# EAGLE board SparkFun RTK Express (EAGLE 9.6.2)
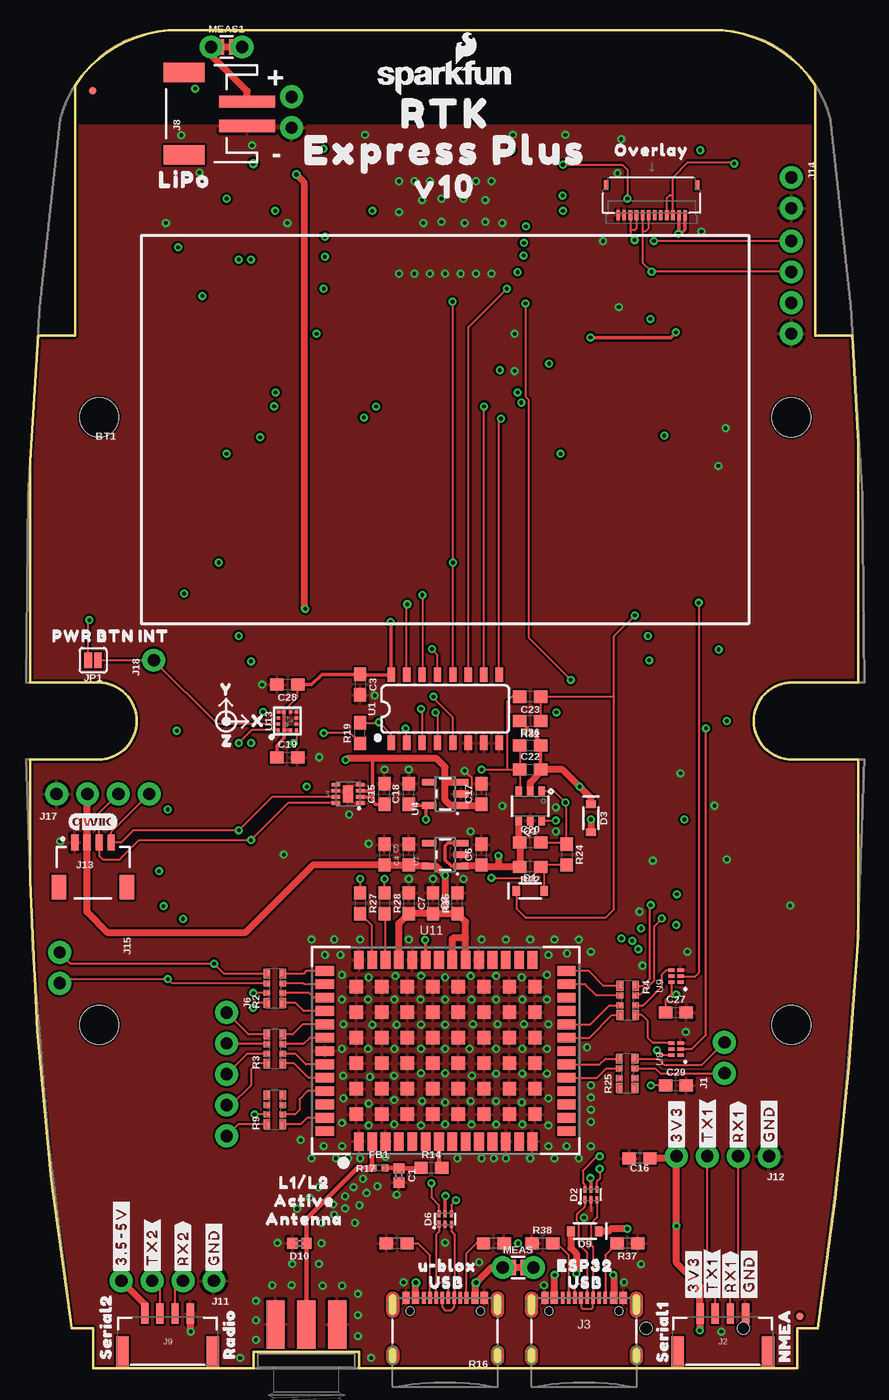
[diagram p2: board, top side]
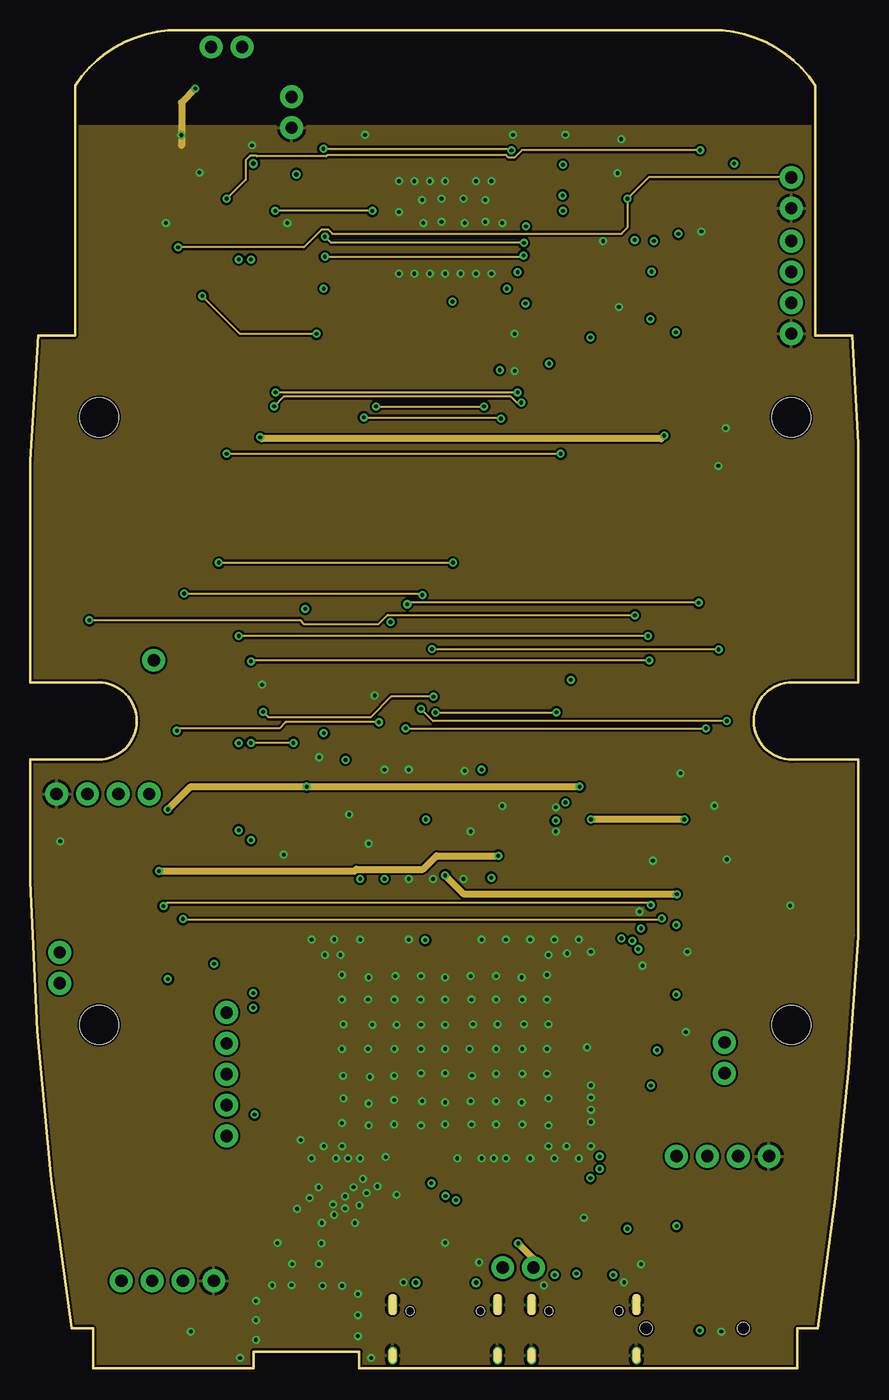
[diagram p3: board, inner layer GND/Horz]
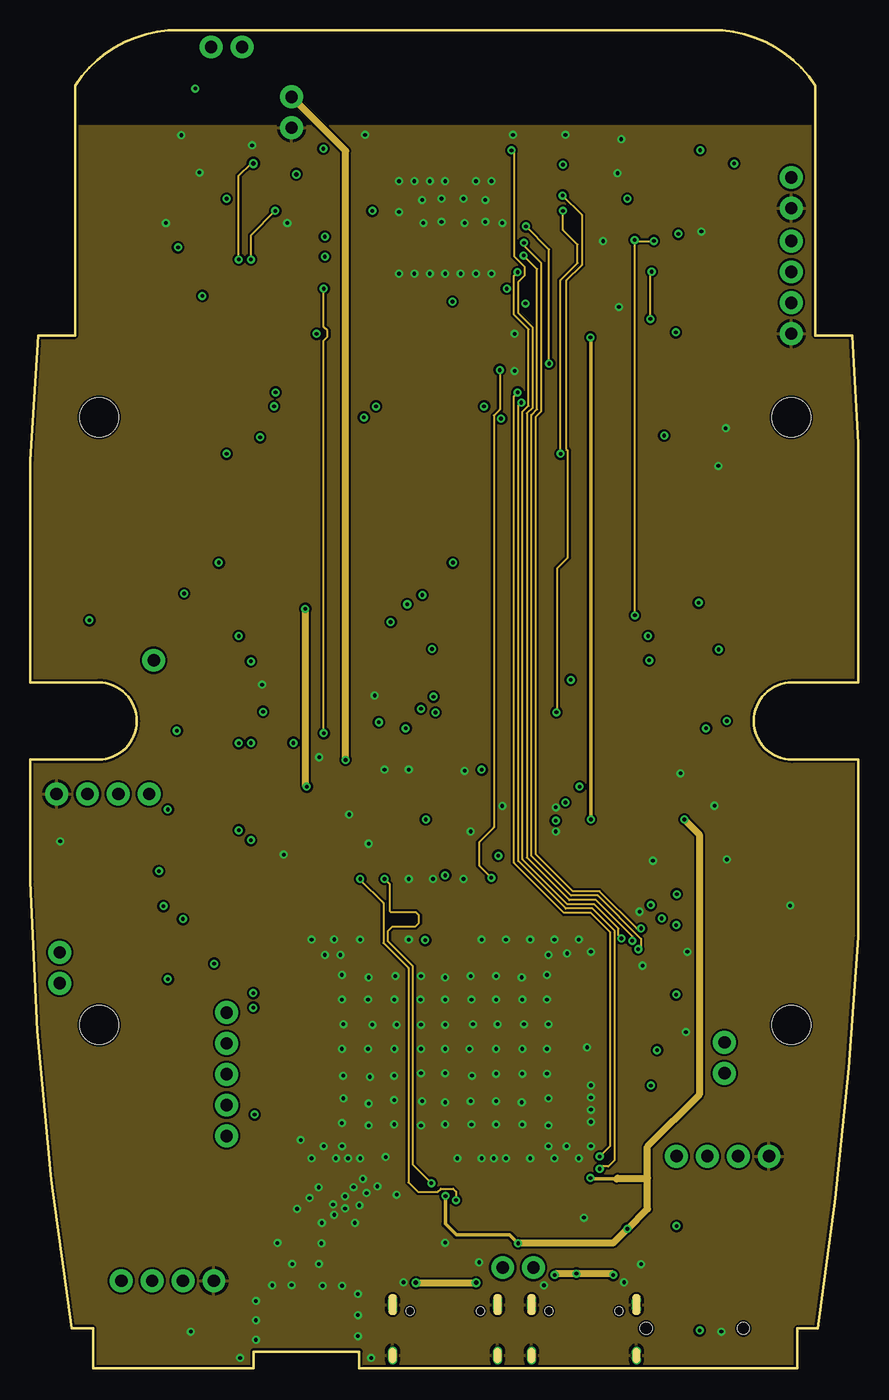
[diagram p4: board, inner layer Vert]
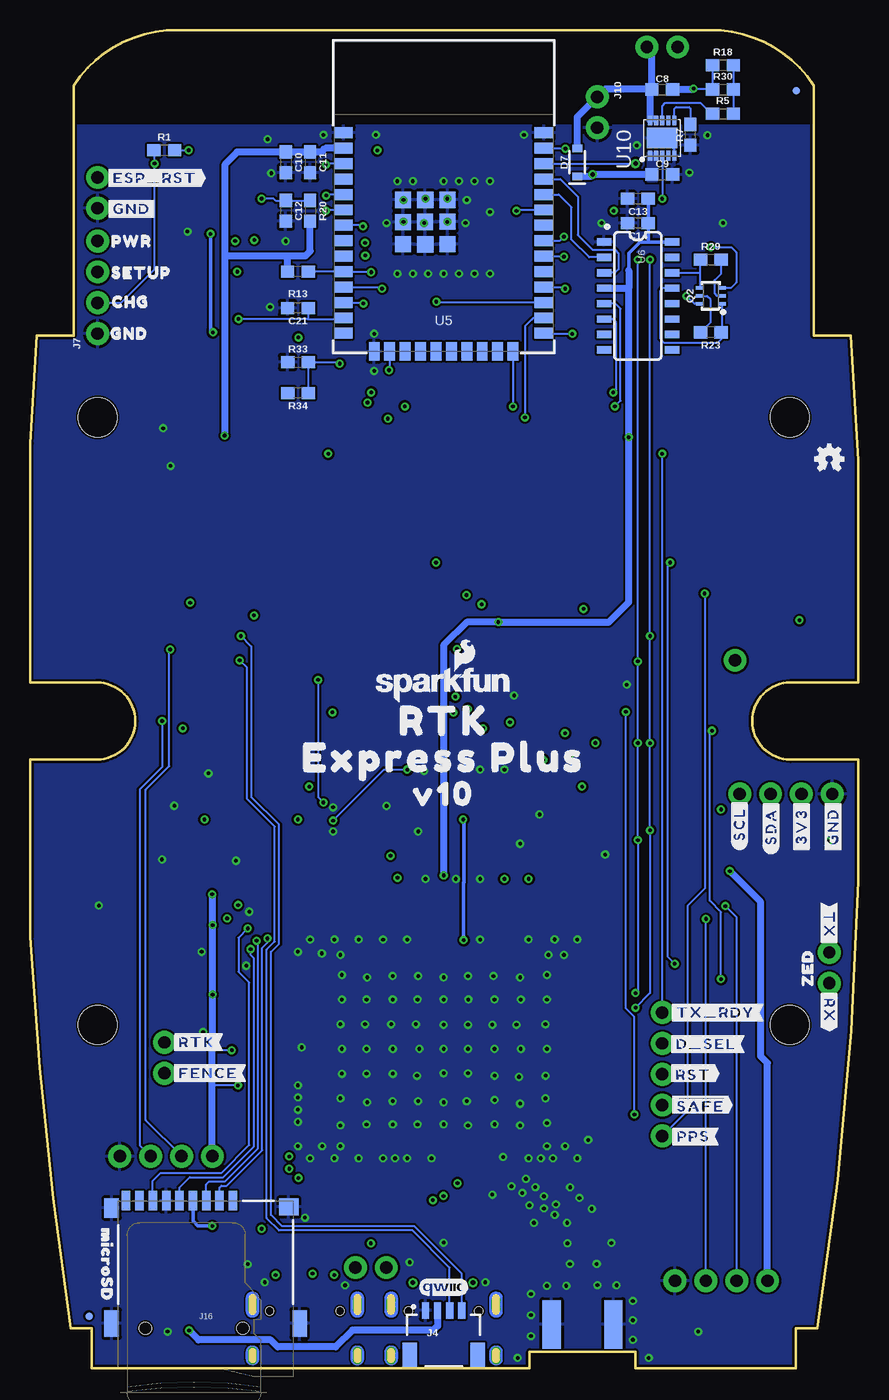
[diagram p5: board, bottom side, seen from below]

Size 68.2 x 110.14 mm. Coordinates in mm from the lower left corner, seen from the top.
Outline: 0,74.74 0,56.45 5.59,56.45 arc-180 5.59,50.1 0,50.1 0,40.07 arc8 3.41,3.27 5.16,3.27 5.16,0 18.39,0 18.39,1.36 27.09,1.36 27.09,0 63.16,0 63.16,3.27 64.86,3.27 arc5 68.2,35.49 68.2,50.1 62.74,50.1 arc-180 62.74,56.45 68.2,56.45 68.2,76.14 67.69,85.03 64.64,85.03 64.64,105.6 arc52 56.97,110.14 11.35,110.14 arc52 3.68,105.6 3.68,85.03 0.64,85.03 0,74.74
Outline: 0,74.74 0,74.87
Copper layers (1*2*15*16): Top/Horz 0.035559375mm / dielectric 0.47751875mm / GND/Horz 0.035559375mm / dielectric 0.47751875mm / Vert 0.035559375mm / dielectric 0.47751875mm / Bottom/Vert 0.035559375mm
Design rules "SparkFun-4-layer-TIGHT *": minimum track width 7mil, minimum drill 12mil, track to track 7mil, track to pad 7mil, pad to pad 7mil, via to via 7mil, smd to smd 7mil, copper to edge 7mil, drill to drill 7mil, minimum pad ring 7mil, minimum via ring 7mil, stop-mask expansion 4mil, vias tented up to drill 25mil, thermal gap 10mil
Net classes: 1 power: width 0.178 mm; 2 3.3V: width 0.559 mm; 3 RF: width 0.35 mm, clearance 0.203 mm

## Footprints (pad centres in the part's own frame; a part is rotated, then mirrored left to right if it is on the bottom)
0402 = smd 0.85 x 0.9: 1 -0.58,0; 2 0.58,0
0603 = smd 1.1 x 1: 1 -0.85,0; 2 0.85,0
SOD-323 = smd 0.63 x 0.83: A 1.15,0; C -1.15,0
SOT886 = smd 0.61 x 0.25: 1 -0.405,0.5 | smd 0.56 x 0.25: 2 -0.43,0; 3 -0.43,-0.5; 4 0.43,-0.5; 5 0.43,0; 6 0.43,0.5
SMA-EDGE = smd 1.5 x 4: GND@0 -2.54,0; GND@1 2.54,0; SIG 0,0 | smd 1.5 x 4 bottom: GND@2 -2.54,0; GND@3 2.54,0
0402-TIGHT = smd 0.6 x 0.6: 1 -0.5,0; 2 0.5,0
1X02_NO_SILK = drill 1.016 pad 1.88: 1 0,0; 2 2.54,0
JST-4-SMD-1.25MM-LOCKING = smd 0.6 x 1.7: 1 -1.875,3.3; 2 -0.625,3.3; 3 0.625,3.3; 4 1.875,3.3 | smd 1 x 2.7: NC1 3.725,0.1; NC2 -3.725,0.1
USB-C-16P_4LAYER-PADS = smd 0.3 x 1: A5 -1.25,-0.34; A6 -0.25,-0.34; A7 0.25,-0.34; A8 1.25,-0.34; B5 1.75,-0.34; B6 0.75,-0.34; B7 -0.75,-0.34; B8 -1.75,-0.34 | smd 0.6 x 1: GND -3.225,-0.34; GND2 3.225,-0.34; VBUS1 -2.45,-0.34; VBUS2 2.45,-0.34 | drill 0.4 pad 0.6 long: SHLD1 -4.318,-0.915; SHLD2 4.318,-0.915; SHLD3 -4.318,-5.095; SHLD4 4.318,-5.095 | hole 0.65: -2.89,-1.445; 2.89,-1.445
JST04_1MM_RA = smd 0.6 x 1.35: 1 -1.5,0; 2 -0.5,0; 3 0.5,0; 4 1.5,0 | smd 1.2 x 2: NC1 2.8,-3.675; NC2 -2.8,-3.675
1X05_NO_SILK = drill 1.016 pad 1.88: 1 0,0; 2 2.54,0; 3 5.08,0; 4 7.62,0; 5 10.16,0
1X04_NO_SILK = drill 1.016 pad 1.88: 1 0,0; 2 2.54,0; 3 5.08,0; 4 7.62,0
JST-2-SMD = smd 1 x 4.6: 1 -1,-3.7; 2 1,-3.7 | smd 1.6 x 3.4: NC1 -3.4,1.5; NC2 3.4,1.5
MICROSD-EXTERNALPIN = smd 0.7 x 1.6: 1 2.25,10.5; 2 1.15,10.5; 3 0.05,10.5; 4 -1.05,10.5; 5 -2.15,10.5; 6 -3.25,10.5; 7 -4.35,10.5; 8 -5.45,10.5; 9 -6.55,10.5 | smd 1.2 x 1.6: 10 -7.75,9.9 | smd 1.2 x 2.2: 11 -7.75,0.4; 12 7.75,0.4 | smd 1.6 x 1.4: 13 6.85,10 | hole 1: 3.05,0; -4.95,0
1X01_NO_SILK = drill 1.016 pad 1.88: 1 0,0
FPC_12_DOUBLESIDED_BACKFLIP = smd 0.3 x 0.8: 1 -2.75,1.35; 2 -2.25,1.35; 3 -1.75,1.35; 4 -1.25,1.35; 5 -0.75,1.35; 6 -0.25,1.35; 7 0.25,1.35; 8 0.75,1.35; 9 1.25,1.35; 10 1.75,1.35; 11 2.25,1.35; 12 2.75,1.35 | smd 0.4 x 0.8: MP1 -3.75,-1.15; MP2 3.75,-1.15
SMT-JUMPER_2_NO_SILK = smd 0.635 x 1.27: 1 -0.406,0; 2 0.406,0
FIDUCIAL-MICRO = smd 0.635 x 0.635: 1 0,0
COMBO-JUMPER_2_NC_TRACE = smd 0.635 x 1.27: 1 -0.508,0; 2 0.508,0 | drill 1.016 pad 1.88: 3 -1.27,0; 4 1.27,0
SOT26 = smd 0.55 x 0.8: D1 -0.95,1.2; D2 0.95,1.2; G1 -0.95,-1.2; G2 0.95,-1.2; S1 0,1.2; S2 0,-1.2
SC70-6 = smd 0.3 x 0.66: 1 -0.65,-0.92; 2 0,-0.92; 3 0.65,-0.92; 4 0.65,0.92; 5 0,0.92; 6 -0.65,0.92
1206_RA = smd 0.8 x 0.55: P1 -1.2,-0.62; P4 1.2,-0.62; P5 1.2,0.68; P8 -1.2,0.68 | smd 0.5 x 0.55: P2 -0.4,-0.62; P3 0.4,-0.62; P6 0.4,0.68; P7 -0.4,0.68
SO16 = smd 0.6 x 1.2: 1 -4.445,-2.8; 2 -3.175,-2.8; 3 -1.905,-2.8; 4 -0.635,-2.8; 5 0.635,-2.8; 6 1.905,-2.8; 7 3.175,-2.8; 8 4.445,-2.8; 9 4.445,2.8; 10 3.175,2.8; 11 1.905,2.8; 12 0.635,2.8; 13 -0.635,2.8; 14 -1.905,2.8; 15 -3.175,2.8; 16 -4.445,2.8
SOT23-5 = smd 0.55 x 1.2: 1 -0.95,-1.3; 2 0,-1.3; 3 0.95,-1.3; 4 0.95,1.3; 5 -0.95,1.3
ESP-WROOM-32D-NARROW = smd 0.9 x 1.5: 1 6.43,8.238; 2 5.16,8.238; 3 3.89,8.238; 4 2.62,8.238; 5 1.35,8.238; 6 0.08,8.238; 7 -1.19,8.238; 8 -2.46,8.238; 9 -3.73,8.238; 10 -5,8.238; 11 -6.27,8.238; 12 -7.54,8.238; 13 -8.81,8.238; 14 -10.08,8.238; 25 -10.08,-8.238; 26 -8.81,-8.238; 27 -7.54,-8.238; 28 -6.27,-8.238; 29 -5,-8.238; 30 -3.73,-8.238; 31 -2.46,-8.238; 32 -1.19,-8.238; 33 0.08,-8.238; 34 1.35,-8.238; 35 2.62,-8.238; 36 3.89,-8.238; 37 5.16,-8.238; 38 6.43,-8.238 | smd 1.5 x 0.9: 15 -11.57,5.715; 16 -11.57,4.445; 17 -11.57,3.175; 18 -11.57,1.905; 19 -11.57,0.635; 20 -11.57,-0.635; 21 -11.57,-1.905; 22 -11.57,-3.175; 23 -11.57,-4.445; 24 -11.57,-5.715 | smd 1.33 x 1.33: GND1 -0.912,1.531; GNDT1 -2.751,3.346; GNDT2 -2.761,1.516; GNDT3 -2.751,-0.314; GNDT4 -0.891,-0.324; GNDT5 0.909,-0.314; GNDT6 0.909,1.516; GNDT7 0.909,3.346; GNDT8 -0.921,3.346
SO016 = smd 0.6 x 1.2: 1 -4.445,-2.8; 2 -3.175,-2.8; 3 -1.905,-2.8; 4 -0.635,-2.8; 5 0.635,-2.8; 6 1.905,-2.8; 7 3.175,-2.8; 8 4.445,-2.8; 9 4.445,2.8; 10 3.175,2.8; 11 1.905,2.8; 12 0.635,2.8; 13 -0.635,2.8; 14 -1.905,2.8; 15 -3.175,2.8; 16 -4.445,2.8
DFN-8 = smd 0.3 x 0.7: 1 -0.75,-0.99; 2 -0.25,-0.99; 3 0.25,-0.99; 4 0.75,-0.99; 5 0.75,0.99; 6 0.25,0.99; 7 -0.25,0.99; 8 -0.75,0.99 | smd 1.38 x 0.8: 9 0,0
SIP6 = smd 0.3 x 0.52: P1 -0.508,-0.381; P2 -0.008,-0.381; P3 0.492,-0.381; P4 0.492,0.369; P5 -0.008,0.369; P6 -0.508,0.369
DFN-10 = smd 0.8 x 0.35: 1 -1.45,1; 2 -1.45,0.5; 3 -1.45,0; 4 -1.45,-0.5; 5 -1.45,-1; 6 1.45,-1; 7 1.45,-0.5; 8 1.45,0; 9 1.45,0.5; 10 1.45,1 | smd 1.7 x 2.5: 11 0,0
UBLOX_ZED_F9R = smd 1.1 x 1.1: G1 -7.312,-5.37; G2 -5.212,-5.37; G3 -3.112,-5.37; G4 -1.012,-5.37; G5 1.088,-5.37; G6 3.188,-5.37; G7 5.288,-5.37; G8 7.388,-5.37; G9 7.388,-3.27; G10 5.288,-3.27; G11 3.188,-3.27; G12 1.088,-3.27; G13 -1.012,-3.27; G14 -3.112,-3.27; G15 -5.212,-3.27; G16 -7.312,-3.27; G17 -7.312,-1.17; G18 -5.212,-1.17; G19 -3.112,-1.17; G20 -1.012,-1.17; G21 1.088,-1.17; G22 3.188,-1.17; G23 5.288,-1.17; G24 7.388,-1.17; G25 7.388,0.93; G26 5.288,0.93; G27 3.188,0.93; G28 1.088,0.93; G29 -1.012,0.93; G30 -3.112,0.93; G31 -5.212,0.93; G32 -7.312,0.93; G33 -7.312,3.03; G34 -5.212,3.03; G35 -3.112,3.03; G36 -1.012,3.03; G37 1.088,3.03; G38 3.188,3.03; G39 5.288,3.03; G40 7.388,3.03; G41 7.388,5.13; G42 5.288,5.13; G43 3.188,5.13; G44 1.088,5.13; G45 -1.012,5.13; G46 -3.112,5.13; G47 -5.212,5.13; G48 -7.312,5.13 | smd 0.8 x 1.5: P1 -7.112,-7.62; P2 -6.012,-7.62; P3 -4.912,-7.62; P4 -3.812,-7.62; P5 -2.712,-7.62; P6 -1.612,-7.62; P7 -0.512,-7.62; P8 0.588,-7.62; P9 1.688,-7.62; P10 2.788,-7.62; P11 3.888,-7.62; P12 4.988,-7.62; P13 6.088,-7.62; P14 7.188,-7.62; P28 7.188,7.33; P29 6.088,7.33; P30 4.988,7.33; P31 3.888,7.33; P32 2.788,7.33; P33 1.688,7.33; P34 0.588,7.33; P35 -0.512,7.33; P36 -1.612,7.33; P37 -2.712,7.33; P38 -3.812,7.33; P39 -4.912,7.33; P40 -6.012,7.33; P41 -7.112,7.33 | smd 1.5 x 0.8: P15 9.988,-6.77; P16 9.988,-5.67; P17 9.988,-4.57; P18 9.988,-3.47; P19 9.988,-2.37; P20 9.988,-1.27; P21 9.988,-0.17; P22 9.988,0.93; P23 9.988,2.03; P24 9.988,3.13; P25 9.988,4.23; P26 9.988,5.33; P27 9.988,6.43; P42 -9.912,6.43; P43 -9.912,5.33; P44 -9.912,4.23; P45 -9.912,3.13; P46 -9.912,2.03; P47 -9.912,0.93; P48 -9.912,-0.17; P49 -9.912,-1.27; P50 -9.912,-2.37; P51 -9.912,-3.47; P52 -9.912,-4.57; P53 -9.912,-5.67; P54 -9.912,-6.77
LGA-12-LISDH12 = smd 0.275 x 0.25: 1 -0.75,0.75; 2 -0.75,0.25; 3 -0.75,-0.25; 4 -0.75,-0.75; 7 0.75,-0.75; 8 0.75,-0.25; 9 0.75,0.25; 10 0.75,0.75 | smd 0.25 x 0.275: 5 -0.25,-0.75; 6 0.25,-0.75; 11 0.25,0.75; 12 -0.25,0.75
1553DBK-ENCLOSURE = hole 3.2: -25.006,28.499; 25.006,28.499; 25.006,-28.499; -25.006,-28.499

## Placement (x,y rotation side)
BT1  LIPO-OUTLINE1000  [LIPO-1000]  34.16,77.28 90 top
C1  47pF  [0402]  30.35,15.86 270 top
C2  1.0uF  [0603]  35.16,38.27 90 top
C3  0.1uF  [0603]  27.16,56.27 270 top
C4  1.0uF  [0603]  31.16,42.27 90 top
C5  0.1uF  [0603]  29.16,42.27 270 top
C6  1.0uF  [0603]  37.16,42.27 90 top
C7  0.1uF  [0603]  31.16,38.27 270 top
C8  4.7uF  [0603]  16.16,105.28 0 bottom
C9  4.7uF  [0603]  16.16,98.28 0 bottom
C10  10uF  [0603]  47.16,99.28 270 bottom
C11  0.1uF  [0603]  45.16,99.28 270 bottom
C12  0.1uF  [0603]  47.16,95.28 270 bottom
C13  0.1uF  [0603]  18.16,96.28 180 bottom
C14  10uF  [0603]  18.16,94.28 180 bottom
C15  0.1uF  [0603]  29.16,47.27 90 top
C16  0.1uF  [0603]  50.16,17.27 180 top
C17  1.0uF  [0603]  37.16,47.27 90 top
C18  1.0uF  [0603]  31.16,47.27 90 top
C19  10uF  [0603]  21.16,50.27 0 top
C20  10uF  [0603]  41.16,43.27 0 top
C21  0.1uF  [0603]  46.16,87.28 180 bottom
C22  0.1uF  [0603]  41.16,49.27 0 top
C23  0.1uF  [0603]  41.16,55.27 180 top
C27  0.1uF  [0603]  53.16,29.27 0 top
C28  0.1uF  [0603]  21.16,56.27 180 top
C29  0.1uF  [0603]  53.16,23.27 0 top
D1  250mA/100V  [SOD-323]  41.16,39.27 0 top
D2  PRTR5V0U2F  [SOT886]  46.16,14.28 90 top
D3  3A/10V/280mV  [SOD-323]  46.16,45.27 270 top
D6  PRTR5V0U2F  [SOT886]  34.16,12.28 90 top
D7  3A/10V/280mV  [SOD-323]  23.16,99.28 90 bottom
D9  3A/10V/280mV  [SOD-323]  45.66,11.28 180 top
D10  PESD0402  [0402]  22.16,10.28 180 top
E1  SMA  [SMA-EDGE]  22.73,3.6 180 top
FB1  2.66Ω  [0402-TIGHT]  28.7,16.5 0 top
FRAME2  FRAME-LEDGER  [CREATIVE_COMMONS]  91.67,6.62 0 top  (outside the outline)
FRAME3  FRAME-LEDGERNO_FOOTPRINT  [DUMMY]  -3.38,-7.34 0 top  (outside the outline)
J1  [1X02_NO_SILK]  57.16,24.27 90 top
J2  [JST-4-SMD-1.25MM-LOCKING]  57.02,1.19 0 top
J3  USB Female Type C Connector  [USB-C-16P_4LAYER-PADS]  45.59,6.14 0 top
J4  External  [JST04_1MM_RA]  34.16,4.75 0 bottom
J5  USB Female Type C Connector  [USB-C-16P_4LAYER-PADS]  34.16,6.14 0 top
J6  [1X05_NO_SILK]  16.16,29.27 270 top
J7  [1X04_NO_SILK]  62.66,85.18 90 bottom
J8  [JST-2-SMD]  14.16,103.28 90 top
J9  [JST-4-SMD-1.25MM-LOCKING]  11.3,1.19 0 top
J10  [1X02_NO_SILK]  21.52,104.67 270 bottom
J11  [1X04_NO_SILK]  15.11,7.19 180 top
J12  [1X04_NO_SILK]  60.83,17.45 180 top
J13  Internal  [JST04_1MM_RA]  5.16,43.27 0 top
J14  [1X02_NO_SILK]  62.66,98.04 270 top
J15  [1X02_NO_SILK]  2.41,34.23 270 top
J16  MICRO-SD-PUSH-PUSH-EXT-PIN  [MICROSD-EXTERNALPIN]  53.76,3.27 0 bottom
J17  Qwiic Right Angle  [1X04_NO_SILK]  2.16,47.27 0 top
J18  [1X01_NO_SILK]  10.16,58.27 90 top
J20  [FPC_12_DOUBLESIDED_BACKFLIP]  51.16,96.28 180 top
JP1  [SMT-JUMPER_2_NO_SILK]  5.16,58.27 180 top
JP21  FIDUCIALUFIDUCIAL  [FIDUCIAL-MICRO]  63.37,4.29 0 top
JP61  FIDUCIALUFIDUCIAL  [FIDUCIAL-MICRO]  5.13,105.17 0 top
JP71  FIDUCIALUFIDUCIAL  [FIDUCIAL-MICRO]  63.37,4.29 0 bottom
JP81  FIDUCIALUFIDUCIAL  [FIDUCIAL-MICRO]  5.13,105.17 0 bottom
LOGO1  OSHW-LOGOMINI  [OSHW-LOGO-MINI]  2.41,74.87 0 bottom
LOGO2  SFE_LOGO_NAME_FLAME.1_INCH  [SFE_LOGO_NAME_FLAME_.1]  34.16,56.27 0 bottom
LOGO3  SFE_LOGO_NAME_FLAME.1_INCH  [SFE_LOGO_NAME_FLAME_.1]  34.16,106.28 0 top
MEAS  [COMBO-JUMPER_2_NC_TRACE]  40.16,8.28 0 top
MEAS1  [COMBO-JUMPER_2_NC_TRACE]  16.16,108.78 0 top
Q1  SIL2308-TP  [SOT26]  41.16,46.27 180 top
Q2  MBT3904DW1T1  [SC70-6]  12.16,88.28 90 bottom
R1  470  [0603]  57.16,100.28 0 bottom
R2  33  [1206_RA]  20.16,31.27 90 top
R3  33  [1206_RA]  20.16,26.27 90 top
R4  33  [1206_RA]  49.16,30.27 270 top
R5  0  [0603]  11.16,103.28 0 bottom
R7  1k  [0603]  13.84,101.54 90 bottom
R9  33  [1206_RA]  20.16,21.27 90 top
R13  100k  [0603]  46.16,90.28 180 bottom
R14  10  [0603]  33.02,16.5 0 top
R15  100k  [0603]  33.16,38.27 270 top
R16  5.1k  [0603]  38.16,10.28 180 top
R17  5.1k  [0603]  30.16,10.28 0 top
R18  10k  [0603]  11.16,107.28 0 bottom
R19  1k  [0603]  27.16,52.27 90 top
R20  100k  [0603]  45.16,95.28 270 bottom
R22  100k  [0603]  41.16,41.27 180 top
R23  10k  [0603]  12.16,85.28 180 bottom
R24  300k  [0603]  44.16,42.27 270 top
R25  33  [1206_RA]  49.16,24.27 90 top
R26  100k  [0603]  41.16,51.27 0 top
R27  27  [0603]  27.16,38.27 270 top
R28  27  [0603]  29.16,38.27 270 top
R29  10k  [0603]  12.16,91.28 0 bottom
R30  150k  [0603]  11.16,105.28 0 bottom
R31  10k  [0603]  41.16,53.27 180 top
R33  10k  [0603]  46.15,82.83 0 bottom
R34  3.3k  [0603]  46.15,80.29 180 bottom
R37  5.1k  [0603]  49.16,10.28 180 top
R38  5.1k  [0603]  42.16,10.28 0 top
U1  74HC4052D  [SO16]  34.16,54.27 0 top
U2  AP2112K-3.3  [SOT23-5]  34.16,42.27 90 top
U4  STLQ015-3.3V  [SOT23-5]  34.16,47.27 90 top
U5  ESP-WROOM-3232D-NARROW  [ESP-WROOM-32D-NARROW]  34.16,95.28 90 bottom
U6  CH340C  [SO016]  18.16,88.28 270 bottom
U7  MAX17048  [DFN-8]  26.16,47.27 90 top
U8  NC7SZ14-D  [SIP6]  53.16,26.27 90 top
U9  NC7SZ14-D  [SIP6]  53.16,32.27 90 top
U10  MCP73833  [DFN-10]  16.16,101.28 90 bottom
U11  U-BLOX_ZED_F9R  [UBLOX_ZED_F9R]  34.16,26.27 0 top
U13  LIS2DH12  [LGA-12-LISDH12]  21.16,53.27 90 top
U$2  SPECIAL_INSTRUCTIONS-ORDERING  [ORDERING_INSTRUCTIONS]  82.08,81.26 0 top  (outside the outline)
U$3  [#TX_RDY#0]  11.76,29.27 0 bottom
U$4  [INT0]  10.16,60.27 0 top
U$5  [#3V3#0]  53.21,17.86 90 top
U$6  [L1#L20]  22.56,15.28 0 top
U$7  [RTK0]  34.16,53.27 0 bottom
U$8  [OVERLAY0]  51.16,100.28 0 top
U$9  [PWR_BTN1]  5.16,60.27 0 top
U$10  [#RTK#1]  56.69,26.82 0 bottom
U$11  [#PPS#0]  15.66,19.07 0 bottom
U$12  [EXPRESS_PLUS0]  34.16,50.27 0 bottom
U$13  [ACTIVE1]  22.56,13.78 0 top
U$14  [#RX#2]  2.41,31.18 270 bottom
U$15  [ANTENNA2]  22.56,12.28 0 top
U$16  [ZED0]  4.19,30.8 90 bottom
U$17  [##SAFE##5]  15.66,21.67 0 bottom
U$20  [V100]  34.16,97.28 0 top
U$21  [V100]  34.16,47.27 0 bottom
U$22  [EXPRESS_PLUS0]  34.16,100.28 0 top
U$23  [#3#5#5V#0]  7.49,7.7 90 top
U$24  [X0]  18.76,53.27 0 top
U$26  [1553DBK-ENCLOSURE]  34.16,53.27 90 top
U$27  [LIPO0]  12.7,97.85 0 top
U$28  [##RST##4]  15.76,24.27 0 bottom
U$29  [SERIAL10]  52.07,-0.18 90 top
U$30  [QWIIC_4MM]  34.16,6.65 0 bottom
U$32  [#FENCE#3]  56.69,24.28 0 bottom
U$33  [CHG2]  59.96,87.78 0 bottom
U$34  [GND3]  60.06,85.18 0 bottom
U$35  [U#BLOX0]  31.24,8.43 0 top
U$36  [USB1]  32.13,7.03 0 top
U$38  [#GND#0]  15.11,7.7 90 top
U$39  [#RX2#2]  12.57,7.7 90 top
U$40  [#TX2#1]  10.03,7.7 90 top
U$41  [PWR0]  59.86,92.78 0 bottom
U$42  [SETUP1]  59.06,90.18 0 bottom
U$43  [SERIAL20]  6.22,0.08 90 top
U$45  [#RX1#2]  57.66,5.51 90 top
U$46  [#TX1#1]  56.13,5.51 90 top
U$47  [#3V3#0]  54.61,5.51 90 top
U$48  [#GND#0]  59.18,5.51 90 top
U$49  [NMEA1]  62.1,-0.18 90 top
U$50  [RADIO0]  16.38,0.08 90 top
U$55  [Y1]  16.16,55.88 0 top
U$56  [Z2]  16.06,51.67 180 top
U$60  [#ESP_RST#0]  62.1,97.98 0 bottom
U$65  [#TX1#1]  55.75,17.86 90 top
U$66  [USB1]  43.56,7.03 0 top
U$67  [ESP320]  42.67,8.43 0 top
U$68  [#RX1#2]  58.29,17.86 90 top
U$70  [#GND#2]  2.1,44.57 90 bottom
U$72  [#TX#1]  2.41,38.29 270 bottom
U$74  [RTK0]  34.16,103.28 0 top
U$82  [#GND#0]  60.83,17.86 90 top
U$83  [MICROSD0]  61.9,12.21 270 bottom
U$84  [#GND#1]  62.1,95.44 0 bottom
U$85  [#3V3#2]  4.7,44.57 90 bottom
U$86  [#SCL#1]  9.8,44.77 90 bottom
U$87  [#SDA#0]  7.2,44.57 90 bottom
U$88  [#D_SEL#0]  12.56,26.67 0 bottom
U$93  [QWIIC_4MM]  5.16,44.98 0 top

## Tracks (layer width: path | path; a pad name or v marks a point on that pad's centre or on a via)
3.3V  (via drill 0.3)
  Top/Horz 0.178: U9.P6 52.79,30.79 | C27.1 52.31,30.31 52.79,30.79 | 52.79,30.79 52.83,30.75 v53.19,30.75 | C29.1 51.12,23.27 v51.11,23.26 | U8.P6 52.02,25.77 v51.61,26.17 | U13.9 20.91,54.16 21.18,54.43 21.19,54.43 22.01,55.26 C28.1 | 23.16,56.27 23.15,56.27
  Top/Horz 0.305: v29.67,61.42 29.72,61.38 U1.16 27.21,57.07 C3.1 24.01,57.12 23.16,56.27 | 20.91,52.6 U13.9 U13.10 | 20.91,52.6 U13.2 20.91,51.87 20.31,51.27 C19.1 | U13.3 20.99,52.52 20.91,52.6 | 23.15,56.27 C28.1
  Top/Horz 0.559: C16.1 53.04,17.27 J12.4 v53.21,11.71 53.21,8.68 55.15,6.75 J2.1 55.15,3.12 v55.12,3.09 | J17.2 4.66,47.23 J13.2 4.66,37.54 6.37,35.84 17.67,35.84 23.26,41.42 C5.2 C4.1 31.26,41.32 U2.5 33.41,41.32 v34.16,40.57 34.16,37.48 34.21,37.42 | U11.P33 35.85,35.45 | 35.85,35.45 35.85,36.74 C2.1 34.21,37.42 | U11.P34 34.75,35.35 34.85,35.45 35.85,35.45 | U11.P38 30.35,36.61 C7.2 R15.2 34.21,37.42
  GND/Horz 0.559: v18.92,76.64 19.05,76.52 51.94,76.52 v52.2,76.77 | v53.23,39.01 35.71,39.01 v34.16,40.57
  Bottom/Vert 0.178: v51.61,26.17 53.2,26.17 53.21,26.18 | v51.11,23.26 53.21,23.26
  Bottom/Vert 0.305: C13.1 C14.1 17.31,92.77 17.26,92.72 | U6.16 17.26,92.72 | 17.26,92.72 18.02,92.72 18.92,91.82 18.92,90.36 | J16.4 54.81,12.11 54.41,11.71 v53.21,11.71
  Bottom/Vert 0.559: 18.92,88.91 v18.92,76.64 18.92,63.06 20.56,61.42 v29.67,61.42 32.25,61.42 34.16,59.52 v34.16,40.57 | 18.92,90.36 18.92,88.91 | U6.4 18.92,88.91 | v52.2,76.77 52.16,76.81 52.16,91.59 | 52.16,91.59 52.16,99.14 51.17,100.12 C10.1 C11.1 44.22,100.12 43.91,100.44 U5.2 | 52.16,91.59 47.01,91.59 | R13.2 47.01,91.59 | 47.01,91.59 45.55,91.59 45.16,91.98 R20.2 | J12.4 53.21,23.26 53.21,26.18 53.21,27.32 53.19,27.35 v53.19,30.75 v53.19,36.47 53.19,38.96 v53.23,39.01 | v55.12,3.09 54.34,2.32 48.4,2.32 47.82,1.74 43.06,1.74 41.68,3.12 35.03,3.12 34.66,3.48 J4.2
ANT_VCC
  Top/Horz 0.35: FB1.2 30.3,16.5 | C1.1 32.11,16.44
  Top/Horz 0.351: 30.3,16.5 C1.1 | 32.11,16.44 R14.1
CC1
  Top/Horz 0.178: J5.A5 32.91,9.3 31.93,10.28 R17.2
CC2
  Top/Horz 0.178: J5.B5 35.91,9.45 36.74,10.28 R16.2
CC3
  Top/Horz 0.178: J3.B5 47.34,8.91 47.34,9.3 R37.2
CC4
  Top/Horz 0.178: J3.A5 44.34,9.3 43.36,10.28 R38.2
CHG_LED  (via drill 0.3)
  GND/Horz 0.178: v55.16,100.28 40.48,100.28 39.87,99.67 39.38,99.67 39.17,99.87 24.45,99.87 24.36,99.78 18.66,99.78 18.63,99.81 18.1,99.81 17.73,99.44 17.73,97.84 v16.16,96.28
  Bottom/Vert 0.178: U10.3 v16.16,96.28 | R1.2 v55.16,100.28
CHG_LED_RES  (via drill 0.3)
  Top/Horz 0.178: v57.96,99.18 57.86,99.28 54.16,99.28 52.91,98.03 52.91,96.58 | J20.4 52.41,96.33 52.66,96.58 52.91,96.58 | J20.3 52.91,96.58
  Bottom/Vert 0.178: R1.1 57.96,100.23 57.96,99.28 v57.96,99.18 57.96,90.48 60.72,87.72 J7.2
CHG_THERM1
  Bottom/Vert 0.178: R18.2 R30.2 R5.2
D+  (via drill 0.3)
  Top/Horz 0.178: v35.05,13.83 34.66,13.44 D6.4 | v27.16,40.27 R27.1
  Vert 0.178: v27.16,40.27 27.16,40.21 29.08,38.29 29.08,34.99 31.14,32.93 31.14,15.29 31.93,14.5 33.54,14.5 33.81,14.77 34.81,14.77 35.05,14.53 v35.05,13.83
D+1  (via drill 0.3)
  Top/Horz 0.178: D2.4 46.66,15.36 46.88,15.58 v46.88,16.4
  GND/Horz 0.178: v40.42,79.49 40.08,79.49 39.6,79.97 20.85,79.97 v20.07,79.18
  Vert 0.178: v40.42,79.49 40.18,79.25 40.18,41.74 44.09,37.83 46.29,37.83 48.08,36.04 48.08,17.09 47.6,16.61 47.09,16.61 v46.88,16.4
  Bottom/Vert 0.178: v20.07,79.18 19.6,79.65 19.6,87.21 20.03,87.64 U6.5
D-  (via drill 0.3)
  Top/Horz 0.178: D6.6 33.66,13.42 33.02,14.06 v33.02,15.23 | R28.1 v29.16,40.27
  Vert 0.178: v33.02,15.23 31.5,16.75 31.5,33.08 29.46,35.11 29.46,36 29.81,36.35 31.71,36.35 32,36.64 32,37.27 31.75,37.53 29.72,37.53 29.59,37.65 29.59,39.85 v29.16,40.27
D-1  (via drill 0.3)
  Top/Horz 0.178: v46.88,17.42 46.64,17.42 45.48,16.26 45.48,15.28 45.66,15.11 D2.6
  GND/Horz 0.178: v40.13,80.33 v20.19,80.33
  Vert 0.178: v40.13,80.33 39.83,80.02 39.83,41.59 43.95,37.48 46.14,37.48 47.73,35.89 47.73,18.26 v46.88,17.42
  Bottom/Vert 0.178: v20.19,80.33 19.95,80.57 19.95,86.06 20.26,86.38 U6.6
ESP32_!DTR
  Bottom/Vert 0.178: U6.13 16.13,88.91 16.33,88.71 16.33,84.76 15.97,84.4 11.64,84.4 11.31,84.73 R23.1 11.24,85.34 Q2.1
ESP32_!RTS
  Bottom/Vert 0.178: R29.1 13.08,91.21 13.08,90.18 | 13.08,90.18 Q2.4 | U6.14 13.09,90.18 13.08,90.18
ESP32_EN  (via drill 0.3)
  Top/Horz 0.178: v43.86,99.08 48.76,99.08 49.16,98.68 v49.16,96.28
  GND/Horz 0.178: v12.16,92.28 22.53,92.28 24.01,93.75 24.5,93.75 24.87,93.39 48.67,93.39 49.16,93.88 v49.16,96.28 50.92,98.04 J14.1
  Bottom/Vert 0.178: R20.1 C12.1 48.01,96.12 48.16,96.28 v49.16,96.28 | v12.16,92.28 10.46,92.28 10.06,91.88 10.06,89.38 10.51,88.93 Q2.3 | v49.16,96.28 | U5.3 43.77,99.17 v43.86,99.08
ESP32_RXI
  Bottom/Vert 0.178: U6.2 22.17,91.45 23.62,92.9 23.62,95.57 24.58,96.52 24.59,96.54 24.68,96.62 U5.34
ESP32_TXO
  Bottom/Vert 0.178: U6.3 20.06,90.18 19.76,90.48 19.76,91.78 20.06,92.08 21.91,92.08 23.11,93.28 23.11,96.46 24.55,97.9 U5.35
ESP_0/BOOT  (via drill 0.3)
  GND/Horz 0.178: v14.16,88.28 17.25,85.19 23.54,85.19 v23.58,85.15
  Bottom/Vert 0.178: Q2.6 13.51,87.62 v14.16,88.28 | U5.25 25.88,85.15 v23.58,85.15
ESP_2/MUX_A  (via drill 0.3)
  Top/Horz 0.178: U1.10 37.34,79.15 v37.36,79.18
  GND/Horz 0.178: v28.46,79.18 v37.36,79.18
  Bottom/Vert 0.178: U5.24 28.45,79.19 v28.46,79.18
ESP_4/ACCEL_INT
  Top/Horz 0.178: U13.12 15.41,53.02 J18.1 JP1.1
ESP_4/MUX_B  (via drill 0.3)
  Top/Horz 0.178: U1.9 38.61,78.02 v38.76,78.18
  GND/Horz 0.178: v27.46,78.28 38.66,78.28 v38.76,78.18
  Bottom/Vert 0.178: v27.46,78.28 27.46,85.78 26.92,86.32 26.86,86.38 26.77,86.47 U5.26
ESP_13/POWER_CTRL  (via drill 0.3)
  Top/Horz 0.178: 42.04,41.25 R22.1 42.16,41.42 R24.2 | 42.04,41.25 42.31,40.98 D1.A | v37.96,40.38 41.16,40.38 42.04,41.25
  Vert 0.178: v38.66,82.18 38.66,78.92 38.17,78.42 38.17,44.52 36.95,43.3 36.95,41.39 v37.96,40.38
  Bottom/Vert 0.178: v38.66,82.18 38.61,82.23 U5.16
ESP_14/SETUP_BUTTON  (via drill 0.3)
  Top/Horz 0.178: J7.3 51.18,90.26 v51.16,90.28 50.41,91.03 50.41,93.58 | J20.7 50.91,93.83 50.66,93.58 50.41,93.58 | J20.8 50.41,93.58
  Vert 0.178: v51.06,86.38 51.06,90.18 v51.16,90.28
  Bottom/Vert 0.178: 45.36,86.38 v51.06,86.38 | 45.36,86.38 42.49,86.38 U5.13 | C21.1 45.31,86.43 45.36,86.38
ESP_18/SCK  (via drill 0.3)
  GND/Horz 0.178: v40.62,91.61 40.51,91.5 v24.26,91.5
  Vert 0.178: v50.06,34.49 50.29,34.72 50.29,35.34 46.73,38.9 44.53,38.9 41.25,42.18 41.25,78.46 | 41.25,78.46 41.73,78.95 | v40.62,91.61 41.73,90.49 41.73,78.95 | 41.73,78.95 | 41.73,78.95 41.25,78.46
  Bottom/Vert 0.178: v24.26,91.5 24.3,91.46 24.39,91.55 U5.30 | v50.06,34.49 50.06,34.01 49.81,33.75 49.81,18.23 | J16.5 55.91,14.87 55.06,15.72 52.32,15.72 49.81,18.23 | 49.81,18.23
ESP_19/CIPO  (via drill 0.3)
  GND/Horz 0.178: v40.64,92.65 24.77,92.65 v24.26,93.16
  Vert 0.178: v50.29,36.19 49.94,36.19 46.88,39.25 44.68,39.25 41.6,42.33 41.6,78.32 42.09,78.8 42.09,90.98 40.64,92.43 v40.64,92.65
  Bottom/Vert 0.178: v50.29,36.19 51.05,35.43 51.05,32.64 50.16,31.75 50.16,18.37 52.46,16.07 57.46,16.07 58.11,15.43 J16.7 | U5.31 24.6,92.82 v24.26,93.16
ESP_21/SDA  (via drill 0.3)
  Top/Horz 0.178: R2.P7 v18.36,30.88 | J17.3 5.66,45.7 J13.3 5.66,42.17 5.96,41.88 7.36,41.88 8.96,43.48 v18.16,43.48 21.21,46.52 U7.8 | U13.4 21.91,51.73 v21.66,51.48
  GND/Horz 0.178: v28.16,95.28 v20.16,95.28 | v50.96,58.27 18.25,58.27 v18.16,58.19 | v21.66,51.48 v18.16,51.48
  Vert 0.178: v18.16,91.28 18.16,93.28 v20.16,95.28
  Bottom/Vert 0.178: v18.36,30.88 18.16,31.07 v18.16,43.48 v18.16,51.48 v18.16,58.19 v18.16,91.28 | J4.3 33.66,8.26 36.72,11.32 47.73,11.32 48.74,12.34 48.74,34.46 48.08,35.13 48.08,44.59 50.36,46.88 50.36,57.67 v50.96,58.27 | U5.33 28.08,95.36 v28.16,95.28
ESP_22/SCL  (via drill 0.3, 0.38)
  Top/Horz 0.178: R2.P8 18.76,30.07 v18.36,29.67 | J13.4 6.66,43.38 | 6.66,43.38 6.66,44.16 J17.4 | 6.66,43.38 6.76,43.27 7.46,43.27 8.46,44.27 v17.16,44.27 19.91,47.02 U7.7 | U13.1 18.23,52.52 v17.16,51.46
  GND/Horz 0.178: v50.86,60.27 v17.16,60.27
  Vert 0.178: v17.16,91.28 17.16,98.18 18.16,99.18 v18.36,99.18
  Bottom/Vert 0.178: v18.36,29.67 17.16,30.88 v17.16,44.27 v17.16,51.46 v17.16,60.27 17.16,91.18 17.21,91.23 v17.16,91.28 | J4.4 32.66,7.77 36.58,11.68 47.45,11.68 48.39,12.61 48.39,34.27 47.73,34.93 47.73,44.74 50.01,47.02 50.01,59.42 v50.86,60.27 | U5.36 v18.37,99.17 v18.36,99.18
ESP_23/COPI  (via drill 0.3)
  GND/Horz 0.178: v24.13,100.39 39.5,100.39 v39.62,100.27
  Vert 0.178: v49.57,35.18 49.57,35.56 46.59,38.54 44.39,38.54 40.89,42.04 40.89,78.61 41.38,79.09 41.38,85.68 40.18,86.87 40.18,89.44 40.73,89.98 40.73,90.65 39.83,91.55 39.83,100.06 v39.62,100.27
  Bottom/Vert 0.178: v49.57,35.18 49.45,35.07 49.45,18.08 52.17,15.36 53.46,15.36 53.71,15.11 J16.3 | U5.37 24.17,100.44 v24.13,100.39
ESP_25/SD_!CS!  (via drill 0.3)
  Vert 0.178: v48.68,35.37 48.44,35.61 48.44,36.19 46.44,38.19 44.24,38.19 40.54,41.89 40.54,78.76 41.02,79.24 41.02,85.53 39.83,86.73 39.83,89.93 v40.13,90.23
  Bottom/Vert 0.178: v40.13,90.23 40.18,90.19 40.27,90.28 U5.10 R13.1 | v48.68,35.37 48.68,35.03 49.1,34.61 49.1,17.93 52.02,15.01 52.46,15.01 52.61,14.86 J16.2
ESP_26/DAC2  (via drill 0.3)
  Top/Horz 0.178: U1.11 36.07,85.71 v39.23,88.88
  Bottom/Vert 0.178: U5.11 39.36,89.01 v39.23,88.88
ESP_26/ZED_TX_READY_LV
  Top/Horz 0.178: R3.P4 21.59,27.47 22.42,28.3 U11.P46
ESP_27/FAST_OFF  (via drill 0.3)
  Top/Horz 0.178: C20.2 44.01,43.27 R24.1 44.16,46.48 v44.06,46.57 43.16,47.48 Q1.G1 | v40.78,87.65 40.78,79.98 41.02,79.73 41.02,60.14 v44.5,56.66
  Bottom/Vert 0.178: U5.12 40.86,87.73 v40.78,87.65 | v44.5,56.66 44.5,47.01 v44.06,46.57
ESP_D1+
  Top/Horz 0.178: J3.A6 45.34,5.01 45.47,4.89 46.23,4.89 46.34,5 J3.B6 46.34,10 46.14,10.2 46.14,11.88 46.66,12.4 D2.3
ESP_D1-
  Top/Horz 0.178: 45.84,6.92 45.84,9.51 45.17,10.18 45.17,11.96 45,12.13 45,12.63 45.11,12.75 45.14,12.78 45.66,13.29 45.66,13.36 D2.1 | 45.84,6.92 J3.A7 | J3.B7 44.84,6.68 45.08,6.92 45.84,6.92
ESP_I16/ZED-TXO1  (via drill 0.3)
  Top/Horz 0.178: U1.12 v34.8,66.32 34.8,87.77 v34.77,87.8 | R2.P5 15.95,32.48 v15.13,33.3 3.34,33.3 J15.1
  GND/Horz 0.178: v15.51,66.32 v34.8,66.32
  Bottom/Vert 0.178: v15.13,33.3 15.73,33.89 15.73,66.1 v15.51,66.32 | v34.77,87.8 34.7,87.73 U5.27
ESP_I34/ZED_TX_READY  (via drill 0.3)
  Top/Horz 0.178: R3.P5 17.96,27.47 J6.1
  GND/Horz 0.178: v16.16,75.28 v43.66,75.28
  Vert 0.178: v43.66,75.28 43.66,89.58 45.06,90.97 45.06,92.5 43.86,93.7 v43.86,95.28
  Bottom/Vert 0.178: v43.86,95.28 v43.85,95.27 43.76,95.36 U5.6 | J6.1 v16.16,75.28
ESP_I35/DEVICE_SENSE  (via drill 0.3)
  Vert 0.178: v42.72,82.7 42.72,92.1 v40.82,94
  Bottom/Vert 0.178: R34.1 R33.2 42.85,82.83 v42.72,82.7 | v40.82,94 40.9,94.09 U5.7
ESP_I39/ADC39  (via drill 0.3)
  Top/Horz 0.178: v33.37,53.98 33.53,53.82 U1.4
  GND/Horz 0.178: v33.37,53.98 43.31,53.98 v43.33,54
  Vert 0.178: v43.83,96.54 45.41,94.96 45.41,90.83 44.12,89.53 44.12,75.67 44.26,75.52 44.26,66.73 43.37,65.84 43.37,54.04 v43.33,54
  Bottom/Vert 0.178: v43.83,96.54 43.74,96.62 U5.5
ESP_O17/ZED-RXI1  (via drill 0.3)
  Top/Horz 0.178: J15.2 2.75,32.02 v11.32,32.02 11.67,31.67 R2.P6 | R19.2 28.65,53.12 v28.7,53.17 29.72,52.16 U1.1
  GND/Horz 0.178: v28.7,53.17 21.02,53.17 20.52,52.68 12.27,52.68 v12.07,52.48
  Bottom/Vert 0.178: v11.32,32.02 11.32,37.55 12.26,38.49 12.26,52.28 v12.07,52.48
EXT_DIR  (via drill 0.3)
  Top/Horz 0.178: U1.15 30.99,62.83 v31.04,62.89 | U9.P2 54.78,32.27 55.04,32.53 v55.04,63.01
  GND/Horz 0.178: v55.04,63.01 31.17,63.01 v31.04,62.89
EXT_WT  (via drill 0.3)
  Top/Horz 0.178: U1.2 30.99,52.6 v30.91,52.68 | U8.P2 54.49,26.27 55.64,27.41 v55.64,52.68
  GND/Horz 0.178: v30.91,52.68 v55.64,52.68
EXTERNAL_DATA_IN  (via drill 0.3)
  Top/Horz 0.178: J2.3 57.65,7 58.29,7.65 J12.2 | v32.16,54.27 32.26,54.18 U1.3
  GND/Horz 0.178: v57.35,53.27 33.16,53.27 v32.16,54.27
  Bottom/Vert 0.178: v57.35,53.27 57.35,49.48 59.18,47.65 59.18,18.33 J12.2
EXTERNAL_DATA_OUT  (via drill 0.3)
  Top/Horz 0.178: J2.2 56.4,7 55.75,7.65 J12.3 | U1.13 33.53,58.73 33.07,59.18 v33.07,59.2
  GND/Horz 0.178: v33.07,59.2 56.65,59.2 v56.69,59.16
  Bottom/Vert 0.178: J12.3 55.75,17.46 58.7,20.41 58.7,47.63 56.76,49.57 56.76,59.09 v56.69,59.16
EXTINT_LV
  Top/Horz 0.178: R9.P2 21.79,20.88 22.16,21.24 22.16,22.14 22.82,22.8 U11.P51
FENCE_LV
  Top/Horz 0.178: U11.P19 46.67,23.9 47.44,24.67 R25.P6
GND  (via drill 0.3)
  Top/Horz 0.178: D2.2 46.16,12.92 | U4.2 36.06,47.27 36.36,47.57 36.36,48.58 36.17,48.77 v35.76,49.17 | 48.91,101.43 v48.66,101.18
  Top/Horz 0.559: J9.4 13.18,3.03 v13.21,3
  GND/Horz 0.559: v13.59,105.34 12.45,104.2 12.45,100.65
  Bottom/Vert 0.178: U10.11 15.64,100.75 15.6,100.75 15.16,100.32 U10.5 | v13.59,105.34 12.08,105.34 R30.1 R18.1
  Bottom/Vert 0.559: C8.2 13.66,105.28 v13.59,105.34
  other vias: 42.29,6.81 56.9,3 30.16,14.28 34.16,10.33 36.96,8.71 30.73,7.06 11.16,94.28 21.16,94.28 28.16,28.27 30.16,28.27 32.16,28.27 34.16,28.27 36.45,28.31 38.48,28.31 40.64,28.31 42.67,28.31 25.78,28.31 27.81,30.34 29.97,30.34 32.13,30.34 34.16,30.34 36.32,30.34 38.35,30.34 40.51,30.34 42.54,30.34 25.65,30.34 27.86,32.17 30.06,32.27 32.16,32.27 34.16,32.17 36.26,32.27 38.36,32.27 40.46,32.17 42.54,32.37 25.65,32.37 27.86,21.77 29.96,22.07 32.26,21.97 34.16,21.88 36.26,21.97 38.36,21.97 40.46,21.88 42.67,22.21 25.78,22.21 27.96,23.97 29.96,24.07 32.16,24.27 34.16,24.27 36.36,24.07 38.35,24.24 40.51,24.24 42.54,24.24 25.76,24.07 27.81,26.27 29.97,26.27 32.16,26.27 34.16,26.27 36.16,26.27 38.35,26.27 40.51,26.27 42.54,26.27 25.65,26.27 27.86,19.97 29.96,20.07 32.16,19.97 34.16,20.07 36.32,20.05 38.35,20.05 40.51,20.05 42.66,19.97 25.65,20.18 26.16,17.27 38.16,17.27 35.16,17.27 37.16,17.27 39.16,17.27 41.16,17.27 25.16,17.27 23.16,35.27 25.02,35.29 27.16,35.27 31.16,35.27 37.16,35.27 39.16,35.27 41.16,35.27 43.16,35.27 45.16,35.27 45.85,26.4 46.16,23.27 46.16,22.27 46.16,20.27 46.16,18.27 46.16,34.27 42.66,18.27 45.16,17.27 43.16,17.27 27.16,17.27 27.38,15.59 26.62,14.9 25.91,14.13 24.92,13.47 23.75,14.89 22.99,14 24,11.96 21.56,8.58 21.5,6.83 19.93,6.83 23.76,8.58 18.57,5.53 18.57,3.93 17.27,0.84 18.57,2.34 25.02,12.62 25.91,13.13 23.16,17.27 22.26,18.77 24.16,18.27 21.97,13.11 27.1,13.4 27.69,14.41 28.57,14.97 26.72,11.96 24.06,6.78 25.66,6.78 26.97,6.1 26.97,4.36 26.97,2.64 28.07,0.84 29.26,17.38 25.66,18.27 25.53,34.02 24.26,34.02 42.67,34.02 44.2,34.15 44.16,18.27 20.34,10.3 23.96,10.28 30.35,95.19 32.36,94.28 37.46,96.18 37.46,94.38 36.7,90.11 35.43,90.11 34.16,90.11 32.89,90.11 31.62,90.11 30.35,90.11 30.35,97.73 31.62,97.73 32.89,97.73 34.16,97.73 36.7,97.73 37.97,97.73 37.97,90.11 32.26,96.18 38.86,94.28 33.86,94.38 33.86,96.28 35.66,96.28 35.76,94.28 48.89,7.06 44.07,101.54 39.75,101.54 27.56,101.54 39.88,85.15 39.88,82.1 46.16,21.27 50.29,8.55 45.59,12.38 56.66,74.28 48.36,98.38 31.16,49.27 36.26,44.17 43.26,46.17 43.26,44.17 57.26,77.38 55.26,93.58 18.26,100.68 12.44,101.51 13.93,98.44 31.16,40.27 33.16,40.27 35.66,40.27 27.86,43.17 29.16,49.27 28.36,55.38 26.26,45.57 20.86,42.27 2.46,43.38 56.34,46.3 38.86,46.27 19.09,56.26 23.79,50.3 48.46,87.37 47.16,92.78 53.97,27.67 54.1,34.28 51.26,41.77 57.36,41.88 62.56,38.07 53.54,48.98 50.42,33.13 50.16,37.58
  pour Top/Horz (isolate 0.152, rank 4): 0.16,102.28 0.16,0.28 68.16,0.28 68.16,102.28
  pour Bottom/Vert (isolate 0.152, rank 4): 68.16,102.28 68.16,0.28 0.16,0.28 0.16,102.28
  pour Vert (isolate 0.152, rank 4): 68.16,102.28 68.16,0.28 0.16,0.28 0.16,102.28
  pour GND/Horz (isolate 0.152, rank 4): 68.16,102.28 68.16,0.28 0.16,0.28 0.16,102.28
GPS_ANT1
  Top/Horz 0.35: 22.73,12.3 26.93,16.5 FB1.1 28.11,16.58 28.15,16.62 U11.P2 | D10.1 E1.SIG
  Top/Horz 0.351: 22.73,12.3 E1.SIG
LIPO_RAW
  Top/Horz 0.559: J8.2 17.86,105.14 14.89,108.11 MEAS1.3 MEAS1.1
N$2
  Top/Horz 0.178: U11.P22 46.03,27.2 47.9,29.07 R4.P4
N$3
  Top/Horz 0.178: U11.P23 46.12,28.3 47.69,29.88 R4.P3
N$4  (via drill 0.38)
  Top/Horz 0.559: J5.VBUS1 31.71,6.99 v31.75,7.03 | J5.VBUS2 36.61,6.94 v36.7,7.03 37.95,8.28 MEAS.3 MEAS.1
  Vert 0.559: v31.75,7.03 v36.7,7.03
N$5
  Bottom/Vert 0.178: U10.8 16.16,103.91 15.9,104.18 13.02,104.18 12.12,103.28 R5.1
N$6  (via drill 0.3)
  Top/Horz 0.178: R19.1 26.31,52.27 v24.16,52.27
  Vert 0.178: v24.16,52.27 24.16,84.59 24.47,84.91 24.47,85.4 24.16,85.71 v24.16,88.88
  Bottom/Vert 0.178: U5.28 24.29,89.01 v24.16,88.88
N$11
  Top/Horz 0.178: R27.2 28.05,36.53 28.11,36.48 28.15,36.44 U11.P40
N$12
  Top/Horz 0.178: U11.P39 29.25,37.34 R28.2
N$13
  Top/Horz 0.35: U11.P7 33.65,16.71 R14.2
N$15  (via drill 0.3)
  Top/Horz 0.178: R26.1 C22.1 40.31,48.98 | 40.31,48.98 40.31,47.57 Q1.G2 | Q1.D1 v43.26,45.07 | v37.16,49.27 39.26,49.27 | 39.26,49.27 40.01,49.27 40.31,48.98 | C23.2 39.66,55.27 39.26,54.88 39.26,49.27
  Bottom/Vert 0.178: v43.26,45.07 39.06,49.27 v37.16,49.27
N$24
  Bottom/Vert 0.178: Q2.5 12.48,88.28 12.16,87.96 12.16,86.12 R23.2
N$25
  Bottom/Vert 0.178: Q2.2 11.63,88.28 11.85,88.49 11.85,89.58 11.31,90.11 R29.2
N$32  (via drill 0.3)
  Top/Horz 0.559: J3.VBUS1 43.14,7.63 v43.18,7.67 | v48.01,7.67 48.04,7.63 J3.VBUS2 | D9.A 44.51,9.9 44.96,9.45 v44.96,7.78
  Vert 0.559: v43.18,7.67 43.29,7.78 v44.96,7.78 47.9,7.78 v48.01,7.67
POWER_BTN  (via drill 0.3)
  Top/Horz 0.178: D1.C 40.01,37.84 40.76,37.09 47.38,37.09 48.06,37.77 48.06,55.27 | R31.1 C23.1 48.06,55.27 | JP1.2 4.76,61.47 v4.86,61.57 | J7.4 v51.34,92.8 | J20.9 49.91,93.83 49.76,93.68 49.41,93.68 | J20.10 49.41,93.68 | 49.41,93.68 49.41,93.23 v49.76,92.88 | v49.78,61.98 48.06,60.26 48.06,55.27
  GND/Horz 0.178: v4.86,61.57 22.22,61.57 22.52,61.28 28.68,61.28 29.42,62.02 49.73,62.02 v49.78,61.98
  Vert 0.178: v51.34,92.8 49.84,92.8 v49.76,92.88 49.76,61.99 v49.78,61.98
PPS_LV
  Top/Horz 0.178: U11.P53 22.8,20.6 22.27,20.07 R9.P1
PROG1
  Bottom/Vert 0.178: R7.2 13.84,103.69 13.97,103.82 15.04,103.82 15.16,103.7 U10.6
RTK_STAT_LV
  Top/Horz 0.178: U11.P20 46.88,25 47.35,25.47 R25.P5
RX2_LV
  Top/Horz 0.178: R4.P2 46.61,30.67 45.68,31.6 U11.P26
RXLV
  Top/Horz 0.178: R2.P3 22.49,31.67 22.56,31.6 U11.P43
SCL_LV
  Top/Horz 0.178: R2.P1 21.83,30.07 22.5,29.4 U11.P45
SDA_LV
  Top/Horz 0.178: R2.P2 22.96,30.88 23.33,30.5 U11.P44
TX2_LV
  Top/Horz 0.178: R4.P1 47.21,31.47 45.98,32.7 U11.P27
TXLV
  Top/Horz 0.178: R2.P4 22.49,32.48 22.72,32.7 U11.P42
UNP_D+
  Top/Horz 0.178: J5.A6 33.91,5.03 34.16,4.78 34.67,4.78 34.92,5.03 34.92,5.79 | 34.92,5.79 J5.B6 | D6.3 34.66,11.25 34.92,10.98 34.92,5.79
UNP_D-
  Top/Horz 0.178: 33.41,7.06 34.16,7.06 34.41,6.81 J5.A7 | J5.B7 33.41,7.06 | D6.1 33.66,11.24 33.41,10.99 33.41,7.06
V_BATT  (via drill 0.3)
  Top/Horz 0.305: C15.1 28.41,46.42 28.16,46.67 28.16,46.98 | 28.16,50.17 28.16,47.48 | 28.16,47.48 28.16,46.98 | U7.2 28.11,47.02 28.16,46.98 | U7.3 28.11,47.52 28.16,47.48
  Top/Horz 0.559: MEAS1.2 MEAS1.4 | C17.1 37.06,46.32 U4.1 34.61,46.32 34.16,46.77 34.16,48.27 | 34.16,48.27 34.16,49.48 33.46,50.17 28.16,50.17 26.06,50.17 v25.96,50.07 | U4.3 34.21,48.23 34.16,48.27
  Vert 0.559: v25.96,50.07 25.96,100.22 J10.1
  Bottom/Vert 0.305: U10.9 U10.10
  Bottom/Vert 0.559: U10.10 17.18,102.75 17.18,105.11 C8.1 | C8.1 17.01,108.36 MEAS1.4 | C8.1 20.91,105.28 J10.1 23.16,103.02 D7.A
V_BKCP  (via drill 0.3)
  Top/Horz 0.305: U4.5 32.56,46.32 | 32.56,46.32 31.26,46.32 C18.1 | v32.56,45.17 32.56,46.32 | U11.P36 32.55,35.2 v32.51,35.24
  Bottom/Vert 0.305: v32.51,35.24 32.51,39.99 32.5,40 32.5,45.12 v32.56,45.17
V_RAW  (via drill 0.3, 0.35)
  Top/Horz 0.305: C22.2 R26.2 42.01,51.57 R31.2
  Top/Horz 0.559: D3.C 46.16,46.94 v45.23,47.88 43.83,49.27 C22.2 42.01,49.07 41.16,48.23 Q1.S2 | v21.9,98.29 22.54,97.65 22.54,62.61 v22.64,62.51
  GND/Horz 0.559: v11.32,45.99 13.2,47.88 v22.76,47.88 v45.23,47.88
  Vert 0.559: v22.64,62.51 22.64,48 v22.76,47.88
  Bottom/Vert 0.559: C9.1 21.89,98.28 | 21.89,98.28 v21.9,98.29 | D7.C 22.04,98.12 21.89,98.28
  pour Bottom/Vert (isolate 0.305, no thermals): 17.4,100.27 17.4,97.73 16.38,97.73 16.38,100.27
V_USB  (via drill 0.3)
  Top/Horz 0.305: D2.5 46.16,15.61 v46.12,15.65 | D6.5 34.16,14.15 v34.18,14.17 | v46.12,84.86 52.74,84.86 v53.16,85.28 | J20.1 53.91,93.73 53.58,93.39 v53.36,93.39 53.41,93.44 J20.2
  Top/Horz 0.559: MEAS.2 MEAS.4 | v49.16,11.47 47.81,11.47 47.61,11.28 D9.C | v46.16,45.17 D3.A
  GND/Horz 0.559: v53.86,45.17 v46.17,45.17 v46.16,45.17 | MEAS.4 41.43,9.01 v40.16,10.28
  Vert 0.305: v34.18,14.17 34.18,11.86 35.08,10.97 39.47,10.97 v40.16,10.28 | 48.29,15.58 46.19,15.58 v46.12,15.65 | v46.16,45.17 46.16,84.82 v46.12,84.86
  Vert 0.559: 50.82,15.64 50.82,13.1 49.19,11.47 v49.16,11.47 47.96,10.28 v40.16,10.28 | 50.82,15.64 50.82,18.24 55.08,22.51 55.08,43.95 v53.86,45.17 | 48.29,15.58 48.35,15.64 50.82,15.64
  Bottom/Vert 0.305: v53.36,93.39 53.36,85.48 v53.16,85.28
VOUT  (via drill 0.3)
  Top/Horz 0.305: U2.1 34.66,41.32 34.16,41.82 34.16,42.98 34.41,43.23 U2.3
  Top/Horz 0.559: Q1.D2 40.21,43.38 C20.1 R22.2 38.53,41.27 | C6.1 37.06,41.32 | 37.06,41.32 U2.1 | 38.53,41.27 37.11,41.27 37.06,41.32 | J9.1 9.43,5.26 J11.4 | v38.53,42.18 38.53,41.27
  GND/Horz 0.559: v10.59,40.91 26.69,40.91 26.84,41.06 32.33,41.06 33.45,42.18 v38.53,42.18
  Bottom/Vert 0.559: J11.4 7.49,25.11 8.05,25.67 8.05,38.38 v10.59,40.91
ZED-RXI2  (via drill 0.3)
  Top/Horz 0.178: J9.3 11.93,6.54 J11.2 | v52,37.02 52.01,37.01 51.38,36.38 51.38,31.92 50.26,30.81 49.98,30.81 R4.P7
  GND/Horz 0.178: v52,37.02 51.87,36.89 12.65,36.89 v12.56,36.98
  Bottom/Vert 0.178: J11.2 v12.57,36.96 v12.56,36.98
ZED-TXO2  (via drill 0.3)
  Top/Horz 0.178: J9.2 10.68,6.54 J11.3 | v51.09,38.12 51.02,38.05 51.02,32.06 50.43,31.47 R4.P8
  GND/Horz 0.178: v51.09,38.12 51.09,38.21 51.01,38.29 11.22,38.29 v10.96,38.03
  Bottom/Vert 0.178: J11.3 10.03,37.1 v10.96,38.03
ZED_!RESET!
  Top/Horz 0.178: R3.P7 17.84,25.88 J6.3
ZED_!RESET!_LV
  Top/Horz 0.178: R3.P2 21.83,25.88 22.7,25 U11.P49
ZED_!SAFE!
  Top/Horz 0.178: J6.4 16.54,21.65 18.16,23.27 18.16,24.57 18.66,25.07 R3.P8
ZED_!SAFE!_LV
  Top/Horz 0.178: U11.P50 22.9,23.9 21.73,25.07 R3.P1
ZED_D_SEL
  Top/Horz 0.178: R3.P6 16.22,26.67 J6.2
ZED_D_SEL_LV
  Top/Horz 0.178: R3.P3 22.49,26.67 23.02,27.2 U11.P47
ZED_DIR
  Top/Horz 0.178: R4.P6 50.48,29.88 51.3,30.69 51.61,31.01 51.99,31.39 51.99,32.41 52.36,32.77 U9.P4
ZED_EXTINT  (via drill 0.3)
  Top/Horz 0.178: R9.P7 v18.46,20.88 | U1.5 34.8,53.58 33.2,55.17 v33.2,55.27
  GND/Horz 0.178: v33.2,55.27 29.7,55.27 28,53.57 19.63,53.57 v19.16,54.04
  Bottom/Vert 0.178: v18.46,20.88 18.46,28.93 19.16,29.63 v19.16,54.04
ZED_FENCE_STAT
  Top/Horz 0.178: R25.P3 51.47,24.67 51.87,24.27 J1.1
ZED_PPS_STAT  (via drill 0.3)
  Top/Horz 0.178: J6.5 17.1,20.05 19.46,20.05 R9.P8 | v32.28,63.65 32.28,57.09 U1.14
  GND/Horz 0.178: v12.66,63.77 32.15,63.77 v32.28,63.65
  Bottom/Vert 0.178: v12.66,63.77 12.66,39.48 14.04,38.1 14.04,21.24 J6.5
ZED_RTK_STAT
  Top/Horz 0.178: R25.P4 51.66,25.47 52.17,24.97 55.32,24.97 J1.2
ZED_WT
  Top/Horz 0.178: U8.P4 51.28,26.77 50.85,27.2 50.85,28.6 50.37,29.07 R4.P5

## Text on the board
tPlace: + | -
tDocu: Board thickness is 1.6mm | 4 Layer Board | No clean process | Controlled Impedance: JLC7628 | Distance from inner lid to PCB surface: | 18.5-5-1.6=11.9mm | 11.9-8=3.9 | 11.9-3.4=8.5mm actuator length on square button | Distance from PCB surface to outer surface of lid: | 11.9+2.75=14.65mm | Face to Lid / LEDs this side | Connectors